# Altium schematic sheet SB_schematic.SchDoc
size B; Author: Hasiuk Ilya; CompanyName: Haute Ecole de La Province de Liège; DocumentNumber: 1; Revision: 0; SheetNumber: 1; SheetTotal: 1
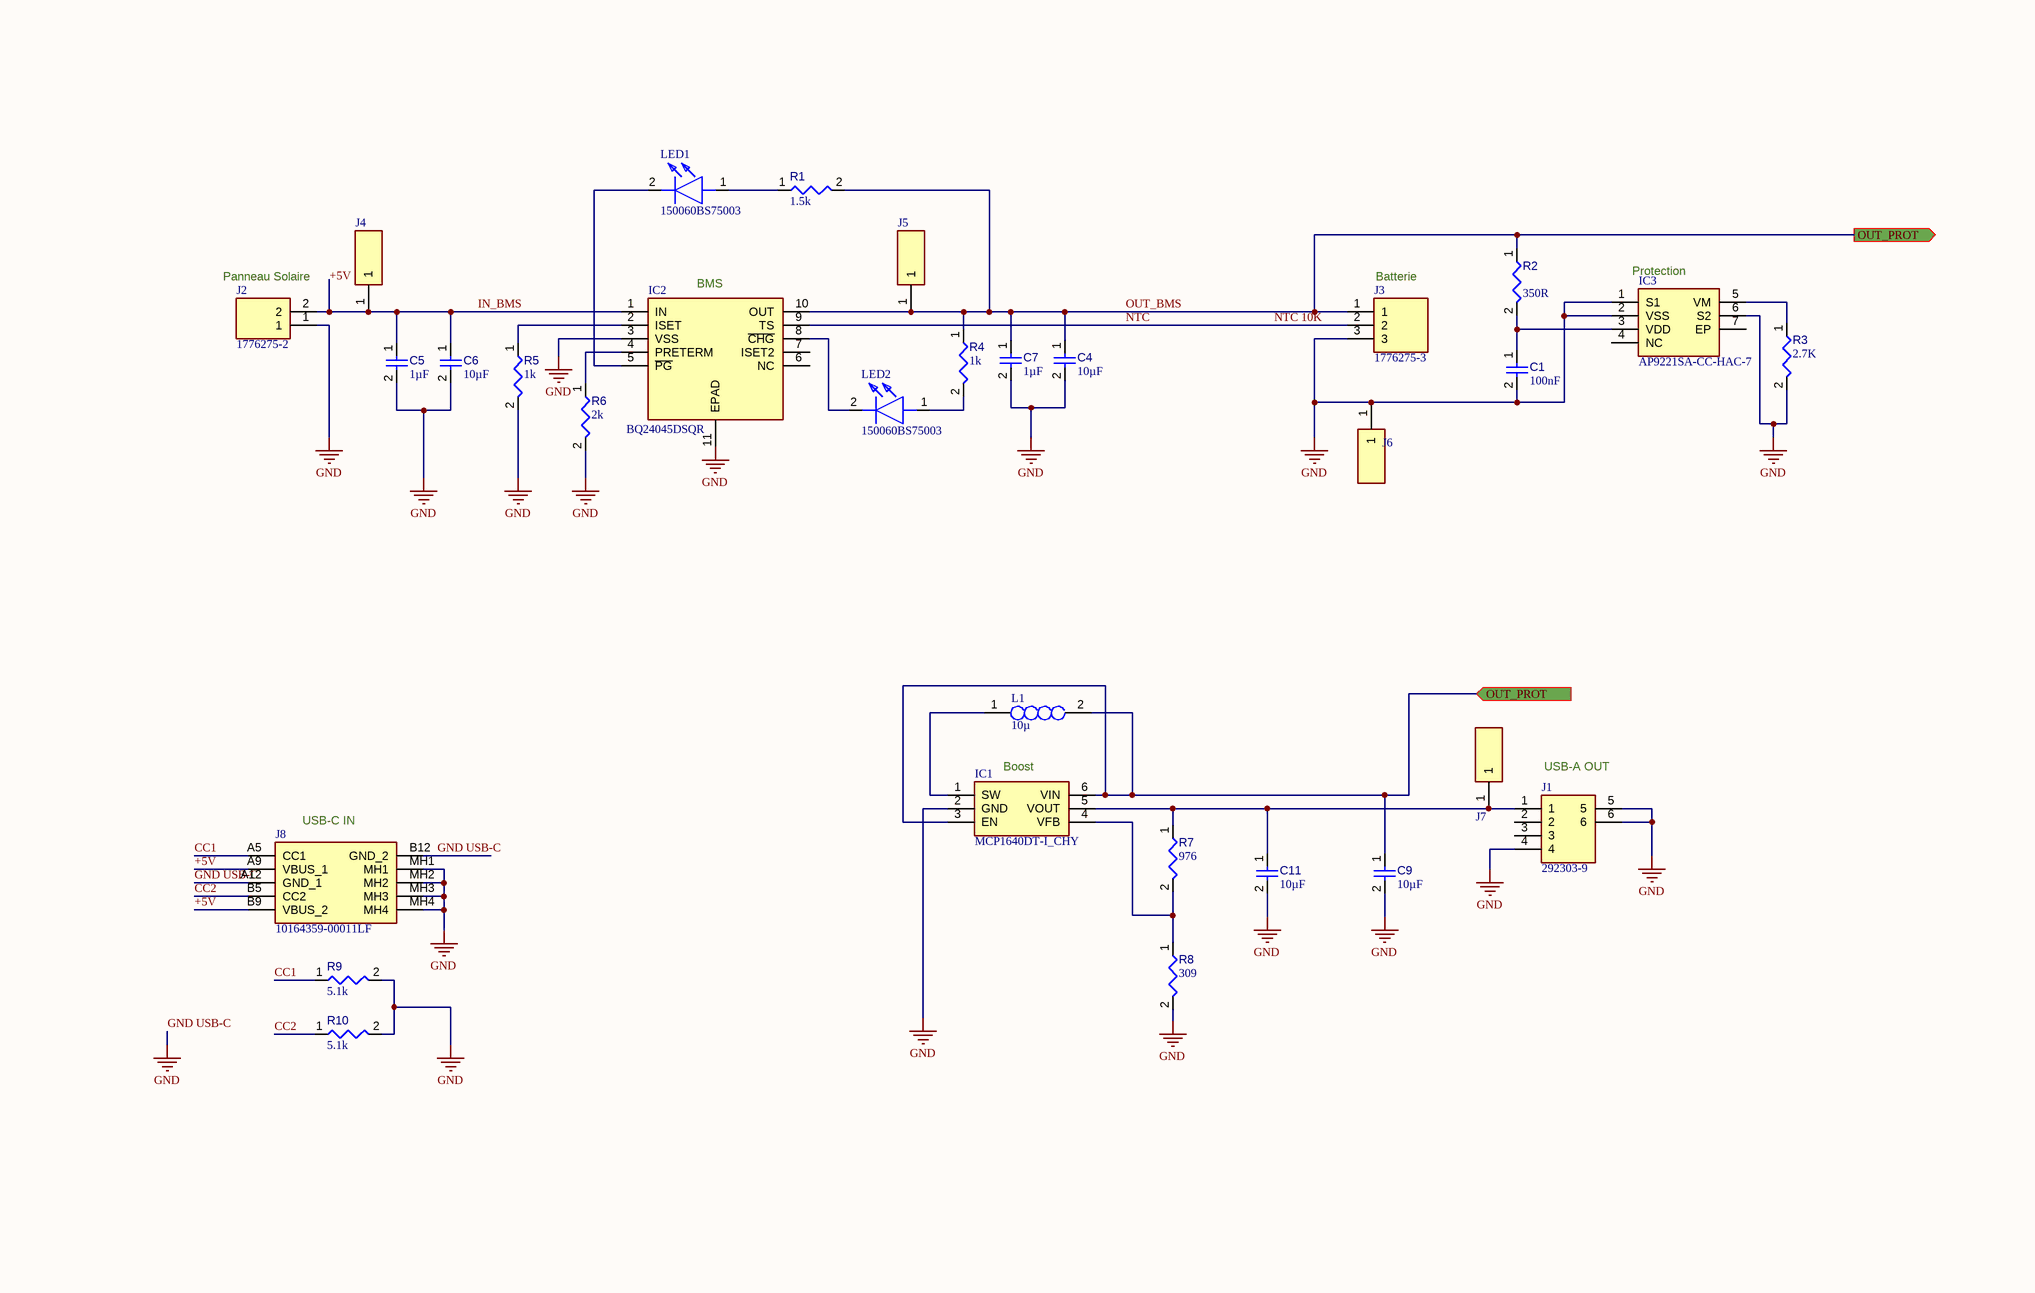
[diagram p0: SB_schematic.SchDoc]

## Parts
C1  value 100nF  [CAPC1608X90X40LL10T20]  (hidden comment: Capacitor 100 nF)
C4  value 10µF  [CAPC1608X90X40LL10T20]  (hidden comment: Capacitor 10 uF)
C5  value 1µF  [CAPC1608X90X40LL10T20]  (hidden comment: Capacitor 1 uF +/- 10% 25 V 0603)
C6  value 10µF  [CAPC1608X90X40LL10T20]  (hidden comment: Capacitor 10 uF)
C7  value 1µF  [CAPC1608X90X40LL10T20]  (hidden comment: Capacitor 1 uF +/- 10% 25 V 0603)
C9  value 10µF  [CAPC1608X90X40LL10T20]  (hidden comment: Capacitor 10 uF)
C11  value 10µF  [CAPC1608X90X40LL10T20]  (hidden comment: Capacitor 10 uF)
IC1  MCP1640DT-I_CHY  [SOT95P270X145-6N]
IC2  BQ24045DSQR  [SON40P200X200X80-11N]
IC3  AP9221SA-CC-HAC-7  [AP9221SACCHAC7]
J1  292303-9  [2923039]
J2  1776275-2  [17762752]
J3  1776275-3  [17762753]
J4  050_LT_B2  [050LTB2]  (value not drawn)
J5  050_LT_B2  [050LTB2]  (value not drawn)
J6  050_LT_B2  [050LTB2]  (value not drawn)
J7  050_LT_B2  [050LTB2]  (value not drawn)
J8  10164359-00011LF  [1016435900011LF]
L1  10µ  [74477710]
LED1  150060BS75003  [150060BS75003]
LED2  150060BS75003  [150060BS75003]
R1  value 1.5k  [RESC0603(1608)_L]  (hidden comment: Resistor 1.5k)
R2  value 350R  [RESC0603(1608)_L]  (hidden comment: Resistor 350R)
R3  value 2.7K  [RESC0603(1608)_L]  (hidden comment: Resistor 2.7k)
R4  value 1k  [RESC0603(1608)_L]  (hidden comment: Resistor 1.5k)
R5  value 1k  [RESC0603(1608)_L]  (hidden comment: Resistor 120R +/-5 % 0603 0.1 W)
R6  value 2k  [RESC0603(1608)_L]  (hidden comment: Resistor 2k)
R7  value 976  [RESC0603(1608)_L]  (hidden comment: Resistor 976R)
R8  value 309  [RESC0603(1608)_L]  (hidden comment: Resistor 309R)
R9  value 5.1k  [RESC0603(1608)_L]  (hidden comment: Resistor 5.1k)
R10  value 5.1k  [RESC0603(1608)_L]  (hidden comment: Resistor 5.1k)

## Ports
OUT_PROT (in, see SB_schematic[1D]), OUT_PROT (out, see SB_schematic[2B])

## Nets
GND USB-C: C1.2 C4.2 C5.2 C6.2 C7.2 C9.2 C11.2 IC1.2(GND) IC2.3(VSS) IC2.11(EPAD) IC3.1(S1) IC3.2(VSS) IC3.6(S2) J1.4 J1.5 J1.6 J2.1 J3.3 J6.1 J8.A12(GND_1) J8.B12(GND_2) J8.MH1 J8.MH2 J8.MH3 J8.MH4 R3.2 R5.2 R6.2 R8.2 R9.2 R10.2  [also labelled GND]
+5V: C5.1 C6.1 IC2.1(IN) J2.2 J4.1 J8.A9(VBUS_1) J8.B9(VBUS_2)  [also labelled IN_BMS]
CC1: J8.A5(CC1) R9.1
CC2: J8.B5(CC2) R10.1
NTC: IC2.9(TS) J3.2  [also labelled NTC 10K]
OUT_BMS: C4.1 C7.1 C9.1 IC1.3(EN) IC1.6(VIN) IC2.10(OUT) J3.1 J5.1 L1.2 R1.2 R2.1 R4.1 ; port OUT_PROT
NetC1_1: C1.1 IC3.3(VDD) R2.2
NetC11_1: C11.1 IC1.5(VOUT) J1.1 J7.1 R7.1
NetIC1_1: IC1.1(SW) L1.1
NetIC1_4: IC1.4(VFB) R7.2 R8.1
NetIC2_2: IC2.2(ISET) R5.1
NetIC2_4: IC2.4(PRETERM) R6.1
NetIC2_5: IC2.5(~{PG}) LED1.2(K)
NetIC2_8: IC2.8(~{CHG}) LED2.2(K)
NetIC3_5: IC3.5(VM) R3.1
NetLED1_1: LED1.1(A) R1.1
NetLED2_1: LED2.1(A) R4.2

Not connected (* = marked no-connect by the designer): IC2 6(NC) 7(ISET2); IC3 4(NC) 7(EP); J1 2 3

## Notes on the sheet
- (near J2) Panneau Solaire
- (near IC2) BMS
- (near J3) Batterie
- (near IC3) Protection
- (near IC1) Boost
- (near J1) USB-A OUT
- (near J8) USB-C IN
- DWG. NO.
- REV.
- SHT.
- THIS DOCUMENT AND THE DATA DISCLOSED HEREIN OR HEREWITH IS THE PROPERTY OF ALTIUM LIMITED AND MAY BE FREELY DISTRIBUTED IN WHOLE. NO RIGHTS ARE RESERVED OR EXPRESS OR IMPLIED WARANTEE GIVEN.
- REVISION
- DESCRIPTION
- DATE
- APPROVED
- ENG:
- APPROVALS
- PROJECT
- DSN:
- CHK:
- REFERENCE DOCUMENTS
- PROJECT REVISION:
- TITLE
- DOCUMENT REVISION:
- DESIGN ITEM:
- BOM:
- FAB DWG:
- PCB DWG:
- ASSY DWG:
- SCALE:
- SIZE
- B
- CAGE CODE
- FILE NAME
- DWG NO.
- SHEET
- OF
- REV

## Library data of the parts
C1 C4 C7 C9 C11 = CMP-001-00005-6: Chip Capacitor, 1 uF, +/- 10%, 25 V, 0603 (1608 Metric); Capacitor Type: Ceramic; Voltage Rating: 25V; Pins: 2; Mounting Technology: SM; RoHS Compliant: True; Max Operating Temperature: 125°C; Case/Package: 0603; Min Operating Temperature: -55°C; Tolerance: 10%
C5 = UMK107BJ105KA-T: Chip Capacitor, 1 uF, +/- 10%, 25 V, 0603 (1608 Metric); Capacitor Type: Ceramic; Voltage Rating: 25V; Pins: 2; Mounting Technology: SM; RoHS Compliant: True; Max Operating Temperature: 125°C; Case/Package: 0603; Min Operating Temperature: -55°C; Tolerance: 10%
C6 = CMP-001-00005-6: Chip Capacitor, 10 uF,; Capacitor Type: Ceramic; Voltage Rating: 25V; Tolerance: 10%; Pins: 2; Mounting Technology: SM; RoHS Compliant: True; Max Operating Temperature: 125°C; Case/Package: 0603; Min Operating Temperature: -55°C
IC1 = MCP1640DT-I_CHY: Integrated Circuit; Manufacturer_Name: Microchip; Manufacturer_Part_Number: MCP1640DT-I/CHY; Datasheet Link: https://componentsearchengine.com/Datasheets/2/MCP1640DT-I_CHY.pdf; Height: 1.45mm; Mouser Part Number: 579-MCP1640DT-I/CHY; Mouser Price/Stock: https://www.mouser.co.uk/ProductDetail/Microchip-Technology/MCP1640DT-I-CHY?qs=Z2DEGP6RHSmcahvjAPXzWA%3D%3D; Arrow Part Number: MCP1640DT-I/CHY; Arrow Price/Stock: https://www.arrow.com/en/products/mcp1640dt-ichy/microchip-technology?region=nac
IC2 = BQ24045DSQR: Integrated Circuit; Manufacturer_Name: Texas Instruments; Datasheet Link: http://www.ti.com/lit/gpn/bq24045; Height: 0.8mm; Manufacturer_Part_Number: BQ24045DSQR; Mouser Part Number: 595-BQ24045DSQR; Mouser Price/Stock: https://www.mouser.co.uk/ProductDetail/Texas-Instruments/BQ24045DSQR?qs=KkE6aTVgMAQPXkV4rQ%2F6tA%3D%3D; Arrow Part Number: BQ24045DSQR; Arrow Price/Stock: https://www.arrow.com/en/products/bq24045dsqr/texas-instruments?region=nac
IC3 = AP9221SA-CC-HAC-7: Integrated Circuit; Manufacturer_Name: Diodes Inc.; Datasheet Link: https://www.diodes.com/assets/Datasheets/AP9221.pdf; Height: 0.65mm; Manufacturer_Part_Number: AP9221SA-CC-HAC-7; Mouser Part Number: 621-AP9221SA-CCHAC-7; Mouser Price/Stock: https://www.mouser.co.uk/ProductDetail/Diodes-Incorporated/AP9221SA-CC-HAC-7?qs=xZ%2FP%252Ba9zWqYP2BSSx9w0XQ%3D%3D; Arrow Part Number: AP9221SA-CC-HAC-7; Arrow Price/Stock: https://www.arrow.com/en/products/ap9221sa-cc-hac-7/diodes-incorporated?region=nac
J1 = 292303-9: Connector; Manufacturer_Name: TE Connectivity; Datasheet Link: http://www.te.com/commerce/DocumentDelivery/DDEController?Action=srchrtrv&DocNm=292303&DocType=Customer+Drawing&DocLang=English&DocFormat=pdf&PartCntxt=292303-9; Height: 7mm; Manufacturer_Part_Number: 292303-9; Mouser Part Number: 571-292303-9; Mouser Price/Stock: https://www.mouser.co.uk/ProductDetail/TE-Connectivity/292303-9?qs=WBj8811fzwEQB%252BEcKzEz4Q%3D%3D; Arrow Part Number: 292303-9; Arrow Price/Stock: https://www.arrow.com/en/products/292303-9/te-connectivity?region=nac
J2 = 1776275-2: Connector; Manufacturer_Name: TE Connectivity; Datasheet Link: https://www.mouser.co.uk/ProductDetail/TE-Connectivity-AMP/1776275-2/?qs=%2Fha2pyFaduh5oRLpYFqVQ2CuT224sRAAEtPMkKhfNDU%3D; Height: 8.6mm; Manufacturer_Part_Number: 1776275-2; Mouser Part Number: 571-1776275-2; Mouser Price/Stock: https://www.mouser.co.uk/ProductDetail/TE-Connectivity/1776275-2?qs=vnwGVgFuQiZz9SD%252Bziemgw%3D%3D; Arrow Part Number: 1776275-2; Arrow Price/Stock: https://www.arrow.com/en/products/1776275-2/te-connectivity?region=nac
J3 = 1776275-3: Connector; Manufacturer_Name: TE Connectivity; Datasheet Link: https://www.te.com/commerce/DocumentDelivery/DDEController?Action=srchrtrv&DocNm=1-1773458-1_EURO_STYLE_QRG&DocType=Data+Sheet&DocLang=English&PartCntxt=1776275-3&DocFormat=pdf; Height: 8.3mm; Manufacturer_Part_Number: 1776275-3; Mouser Part Number: 571-1776275-3; Mouser Price/Stock: https://www.mouser.co.uk/ProductDetail/TE-Connectivity/1776275-3?qs=vnwGVgFuQiaG2mifqnUIBA%3D%3D; Arrow Part Number: 1776275-3; Arrow Price/Stock: https://www.arrow.com/en/products/1776275-3/te-connectivity?region=nac
J4-J7 = 050_LT_B2: Connector; Manufacturer_Name: Oxley; Manufacturer_Part_Number: 050/LT/B2; Datasheet Link: http://www.farnell.com/datasheets/2644146.pdf?_ga=2.63921641.795442872.1562935128-2061028581.1560430415; Height: 4.5mm
J8 = 10164359-00011LF: Connector; Manufacturer_Name: Amphenol; Datasheet Link: https://cdn.amphenol-cs.com/media/wysiwyg/files/drawing/10164359.pdf; Height: 3.41mm; Manufacturer_Part_Number: 10164359-00011LF; Mouser Part Number: 649-10164359-00011LF; Mouser Price/Stock: https://www.mouser.co.uk/ProductDetail/Amphenol-FCI/10164359-00011LF?qs=MyNHzdoqoQLpQ%2FmSqA1%252BtQ%3D%3D; Arrow Part Number: 10164359-00011LF; Arrow Price/Stock: https://www.arrow.com/en/products/10164359-00011lf/amphenol-fci?region=nac
L1 = 74477710: Inductor; Manufacturer_Name: Wurth Elektronik; Datasheet Link: https://www.we-online.com/catalog/datasheet/74477710.pdf; Height: 4.5mm; Manufacturer_Part_Number: 74477710; Mouser Part Number: 710-74477710; Mouser Price/Stock: https://www.mouser.co.uk/ProductDetail/Wurth-Elektronik/74477710?qs=E%2F%2FhvbtCqpNuU6Mc9NsODA%3D%3D
LED1 LED2 = 150060BS75003: LED; Manufacturer_Name: Wurth Elektronik; Datasheet Link: https://www.we-online.com/components/products/datasheet/150060BS75003.pdf; Height: 0.8mm; Manufacturer_Part_Number: 150060BS75003; Mouser Part Number: 710-150060BS75003; Mouser Price/Stock: https://www.mouser.co.uk/ProductDetail/Wurth-Elektronik/150060BS75003?qs=Li%252BoUPsLEnu8LvIbM48DKA%3D%3D
R1-R10 = CMP-009-00176-3: Chip Resistor, 120 Ohms, +/-5 %, 0.1 W, -55 to 155 degC, 0603; Power: 100mW; Tolerance: 5%; Max Operating Temperature: 155°C; Pins: 2; Case/Package: 0603; Min Operating Temperature: -55°C